# EAGLE schematic multiline_shield (EAGLE 9.6.0)
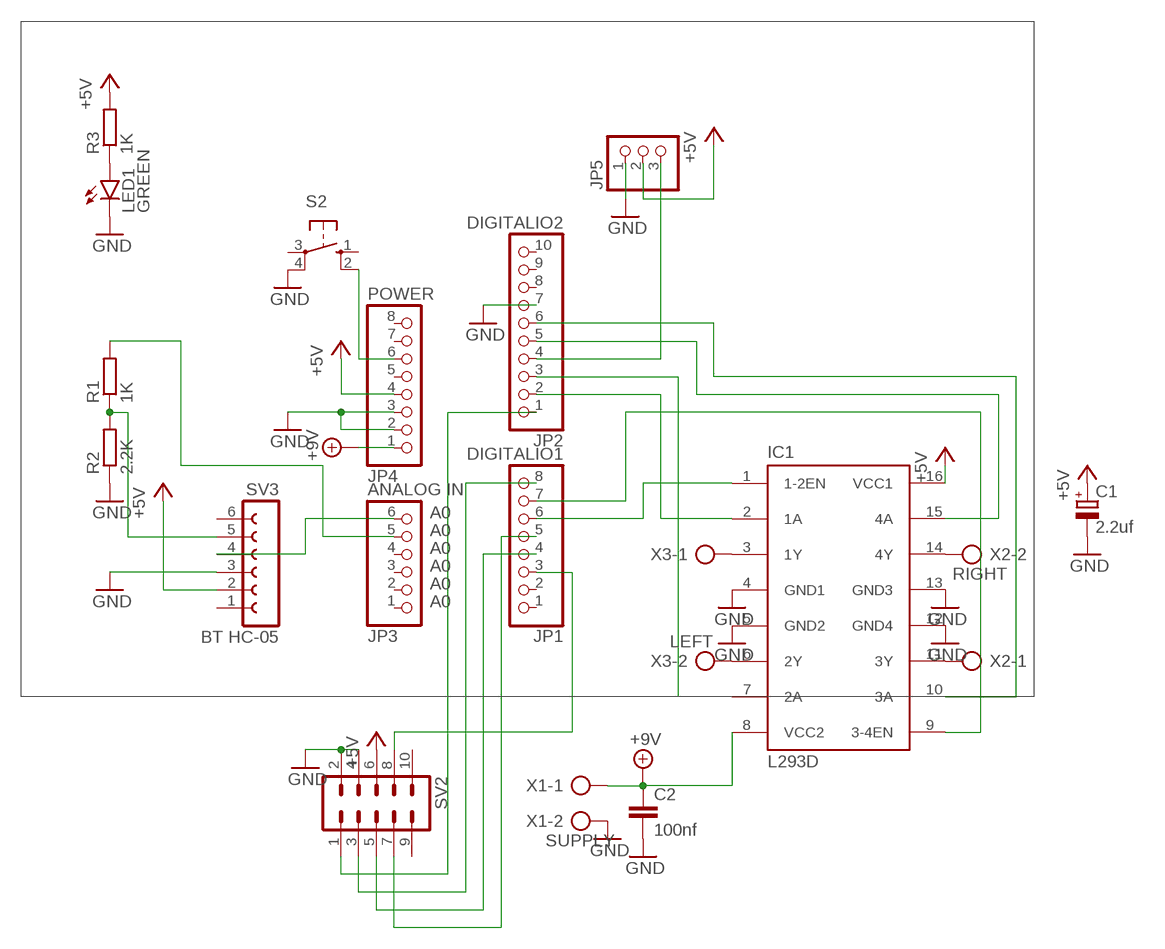
[diagram p0: schematic, sheet 1]

## Parts
C1  2.2uf  CPOL-EUE2.5-6  [E2,5-6]
C2  100nf  C-EU025-025X050  [C025-025X050]
IC1  L293D  [DIL16]
JP1  DIGITALIO1  PINHD-1X8  [1X08]
JP2  DIGITALIO2  PINHD-1X10  [1X10]
JP3  ANALOG IN  PINHD-1X6  [1X06]
JP4  POWER  PINHD-1X8  [1X08]
JP5  PINHD-1X3  [1X03]
LED1  GREEN  LED3MM  [LED3MM]
R1  1K  R-EU_0207/10  [0207/10]
R2  2.2K  R-EU_0207/10  [0207/10]
R3  1K  R-EU_0207/10  [0207/10]
S2  10-XX  [B3F-10XX]
SV2  ML10  [ML10]
SV3  BT HC-05  FE06-1  [FE06]
X1  SUPPLY  AK300/2  [AK300/2]
X2  RIGHT  AK300/2  [AK300/2]
X3  LEFT  AK300/2  [AK300/2]

## Nets
+5V: C1.+ IC1.16(VCC1) JP4.4 JP5.2 R3.2 SV2.6 SV3.2
+9V: C2.1 IC1.8(VCC2) JP4.1 X1.1
GND: C1.- C2.2 IC1.4(GND1) IC1.5(GND2) IC1.12(GND4) IC1.13(GND3) JP2.7 JP4.2 JP4.3 JP5.1 LED1.K(C) R2.1 S2.4(P1) SV2.2 SV2.4 SV3.3 X1.2
N$1: JP3.6 SV3.4
N$2: JP4.6 S2.2(S1)
N$3: R1.1 R2.2 SV3.5
N$4: JP3.5 R1.2
N$5: IC1.2(1A) JP2.2
N$6: JP2.4 JP5.3
N$7: IC1.7(2A) JP2.3
N$8: IC1.1(1-2EN) JP1.6
N$9: IC1.15(4A) JP2.5
N$10: IC1.10(3A) JP2.6
N$11: IC1.9(3-4EN) JP1.7
N$12: IC1.11(3Y) X2.1
N$13: LED1.A R3.1
N$14: IC1.14(4Y) X2.2
N$15: IC1.3(1Y) X3.1
N$16: IC1.6(2Y) X3.2
N$17: JP2.1 SV2.1
N$18: JP1.8 SV2.3
N$19: JP1.4 SV2.5
N$20: JP1.5 SV2.7
N$21: JP1.3 SV2.8
Unconnected: JP1.1 JP1.2 JP2.8 JP2.9 JP2.10 JP3.1 JP3.2 JP3.3 JP3.4 JP4.5 JP4.7 JP4.8 S2.1(S) S2.3(P) SV2.9 SV2.10 SV3.1 SV3.6

## Notes on the sheet
- A0
- A0
- A0
- A0
- A0
- A0

## Library data of the parts
C1 = rcl:CPOL-EU: POLARIZED CAPACITOR, European symbol; SPICEPREFIX: C
C2 = rcl:C-EU: CAPACITOR, European symbol; SPICEPREFIX: C
IC1 = st-microelectronics:L293D: PUSH-PULL 4 CHANNEL DRIVER; MPN: L293D; OC_FARNELL: 9589619; OC_NEWARK: 56P8249
JP1 JP4 = pinhead:PINHD-1X8: PIN HEADER
JP2 = pinhead:PINHD-1X10: PIN HEADER
JP3 = pinhead:PINHD-1X6: PIN HEADER
JP5 = pinhead:PINHD-1X3: PIN HEADER
LED1 = led:LED: LED OSRAM: - CHIPLED LG R971, LG N971, LY N971, LG Q971, LY Q971, LO R971, LY R971 LH N974, LH R974 LS Q976, LO Q976, LY Q976 LO Q996 - Hyper CHIPLED LW Q18S LB Q993, LB Q99A, LB R99A - SideLED LS A670, LO A670, LY A670, LG A670, LP A670 LB A673, LV A673, LT A673, LW A673 LH A674 LY A675 LS A676, LA A676, LO A676, LY A676, LW A676 LS A679, LY A679, LG A679 - Hyper Micro SIDELED® LS Y876, LA Y876, LO Y876, LY Y876 LT Y87S - SmartLED LW L88C, LW L88S LB L89C, LB L89S, LG L890 LS L89K, LO L89K, LY L89K LS L896, LA L896, LO L896, LY L896 - TOPLED LS T670, LO T670, LY T670, LG T670, LP T670 LSG T670, LSP T670, LSY T670, LOP T670, LYG T670 LG T671, LOG T671, LSG T671 LB T673, LV T673, LT T673, LW T673 LH T674 LS T676, LA T676, LO T676, LY T676, LB T676, LH T676, LSB T676, LW T676 LB T67C, LV T67C, LT T67C, LS T67K, LO T67K, LY T67K, LW E67C LS E67B, LA E67B, LO E67B, LY E67B, LB E67C, LV E67C, LT E67C LW T67C LS T679, LY T679, LG T679 LS T770, LO T770, LY T770, LG T770, LP T770 LB T773, LV T773, LT T773, LW T773 LH T774 LS E675, LA E675, LY E675, LS T675 LS T776, LA T776, LO T776, LY T776, LB T776 LHGB T686 LT T68C, LB T68C - Hyper Mini TOPLED® LB M676 - Mini TOPLED Santana® LG M470 LS M47K, LO M47K, LY M47K Source: http://www.osram.convergy.de LUXEON: - LUMILED® LXK2-PW12-R00, LXK2-PW12-S00, LXK2-PW14-U00, LXK2-PW14-V00 LXK2-PM12-R00, LXK2-PM12-S00, LXK2-PM14-U00 LXK2-PE12-Q00, LXK2-PE12-R00, LXK2-PE12-S00, LXK2-PE14-T00, LXK2-PE14-U00 LXK2-PB12-K00, LXK2-PB12-L00, LXK2-PB12-M00, LXK2-PB14-N00, LXK2-PB14-P00, LXK2-PB14-Q00 LXK2-PR12-L00, LXK2-PR12-M00, LXK2-PR14-Q00, LXK2-PR14-R00 LXK2-PD12-Q00, LXK2-PD12-R00, LXK2-PD12-S00 LXK2-PH12-R00, LXK2-PH12-S00 LXK2-PL12-P00, LXK2-PL12-Q00, LXK2-PL12-R00 Source: www.luxeon.com KINGBRIGHT: KA-3528ASYC Source: www.kingbright.com
R1-R3 = rcl:R-EU_: RESISTOR, European symbol; SPICEPREFIX: R
S2 = switch-omron:10-XX: OMRON SWITCH; MPN: B3F-1000; OC_FARNELL: 176432; OC_NEWARK: 36M3542
SV2 = con-harting-ml:ML10: HARTING; OC_FARNELL: unknown; OC_NEWARK: unknown
SV3 = con-lsta:FE06-1: FEMALE HEADER; OC_FARNELL: unknown; OC_NEWARK: unknown
X1-X3 = con-ptr500:AK300/2: CONNECTOR; OC_FARNELL: unknown; OC_NEWARK: unknown